# Altium schematic sheet ESP_32.SchDoc
size A3; SheetNumber: 3; SheetTotal: 4
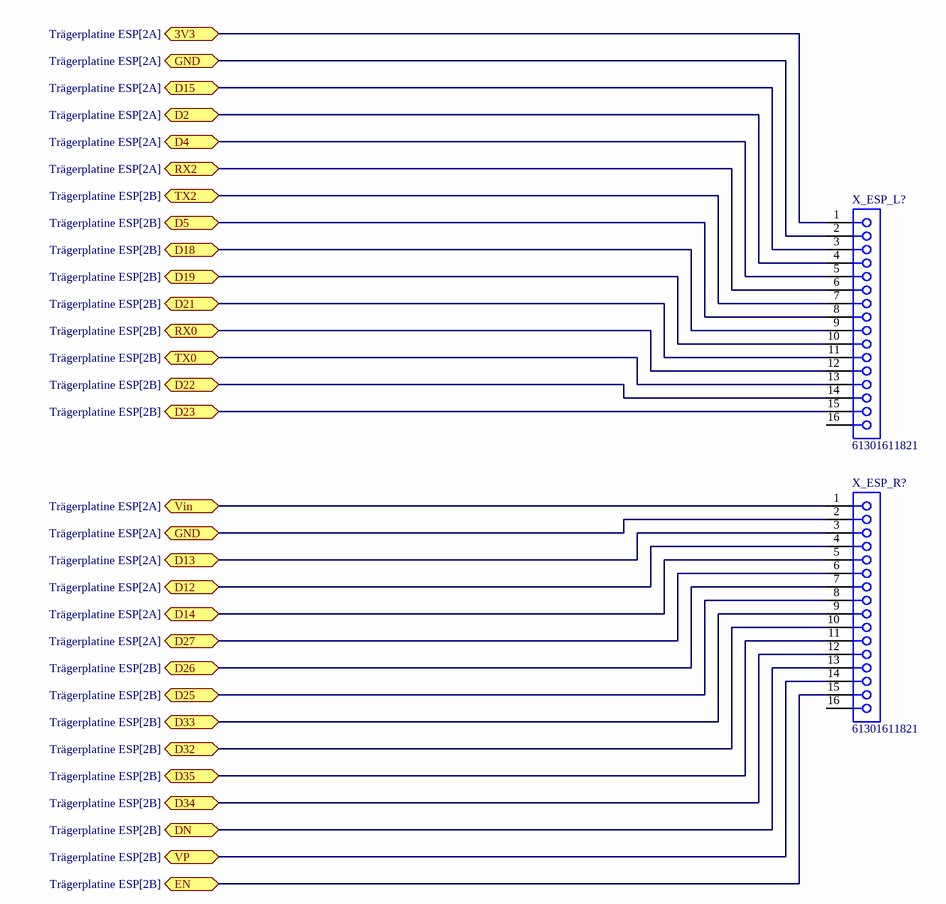
[diagram p0: ESP_32.SchDoc]

## Parts
X_ESP_L?  61301611821  [61301611821]
X_ESP_R?  61301611821  [61301611821]

## Ports
3V3 (bidir, see Trägerplatine ESP[2A]), D2 (bidir, see Trägerplatine ESP[2A]), D4 (bidir, see Trägerplatine ESP[2A]), D5 (bidir, see Trägerplatine ESP[2B]), D12 (bidir, see Trägerplatine ESP[2A]), D13 (bidir, see Trägerplatine ESP[2A]), D14 (bidir, see Trägerplatine ESP[2A]), D15 (bidir, see Trägerplatine ESP[2A]), D18 (bidir, see Trägerplatine ESP[2B]), D19 (bidir, see Trägerplatine ESP[2B]), D21 (bidir, see Trägerplatine ESP[2B]), D22 (bidir, see Trägerplatine ESP[2B]), D23 (bidir, see Trägerplatine ESP[2B]), D25 (bidir, see Trägerplatine ESP[2B]), D26 (bidir, see Trägerplatine ESP[2B]), D27 (bidir, see Trägerplatine ESP[2A]), D32 (bidir, see Trägerplatine ESP[2B]), D33 (bidir, see Trägerplatine ESP[2B]), D34 (bidir, see Trägerplatine ESP[2B]), D35 (bidir, see Trägerplatine ESP[2B]), DN (bidir, see Trägerplatine ESP[2B]), EN (bidir, see Trägerplatine ESP[2B]), GND (bidir, see Trägerplatine ESP[2A]), RX0 (bidir, see Trägerplatine ESP[2B]), RX2 (bidir, see Trägerplatine ESP[2A]), TX0 (bidir, see Trägerplatine ESP[2B]), TX2 (bidir, see Trägerplatine ESP[2B]), Vin (bidir, see Trägerplatine ESP[2A]), VP (bidir, see Trägerplatine ESP[2B])

## Nets
3V3: X_ESP_L?.1 ; port 3V3
D2: X_ESP_L?.4 ; port D2
D4: X_ESP_L?.5 ; port D4
D5: X_ESP_L?.8 ; port D5
D12: X_ESP_R?.4 ; port D12
D13: X_ESP_R?.3 ; port D13
D14: X_ESP_R?.5 ; port D14
D15: X_ESP_L?.3 ; port D15
D18: X_ESP_L?.9 ; port D18
D19: X_ESP_L?.10 ; port D19
D21: X_ESP_L?.11 ; port D21
D22: X_ESP_L?.14 ; port D22
D23: X_ESP_L?.15 ; port D23
D25: X_ESP_R?.8 ; port D25
D26: X_ESP_R?.7 ; port D26
D27: X_ESP_R?.6 ; port D27
D32: X_ESP_R?.10 ; port D32
D33: X_ESP_R?.9 ; port D33
D34: X_ESP_R?.12 ; port D34
D35: X_ESP_R?.11 ; port D35
DN: X_ESP_R?.13 ; port DN
EN: X_ESP_R?.15 ; port EN
GND: X_ESP_L?.2 X_ESP_R?.2 ; port GND
RX0: X_ESP_L?.12 ; port RX0
RX2: X_ESP_L?.6 ; port RX2
TX0: X_ESP_L?.13 ; port TX0
TX2: X_ESP_L?.7 ; port TX2
Vin: X_ESP_R?.1 ; port Vin
VP: X_ESP_R?.14 ; port VP

Not connected (* = marked no-connect by the designer): X_ESP_L? 16; X_ESP_R? 16

## Notes on the sheet
- Engineer:
- Drawn By:
- Number:
- Rev:
- Project Title:
- File:
- Assembly Variant:
- Mod. Date:
- Sheet:
- Size:
- of
- A3
- Approved:
- Contact:

## Library data of the parts
X_ESP_L? X_ESP_R? = CMP-1502-01343-3: NexarPartId: 23389750; Operating Supply Voltage: 250V; Contact Resistance: 20mΩ; Current Rating: 3A; Gender: Female; Number of Pins: 16; Orientation: Vertical; Contact Material: Copper; Lead Free: Lead Free; Lead Pitch: 2.54mm; RoHS: Compliant